# EAGLE schematic USB Interface (EAGLE 6.0)
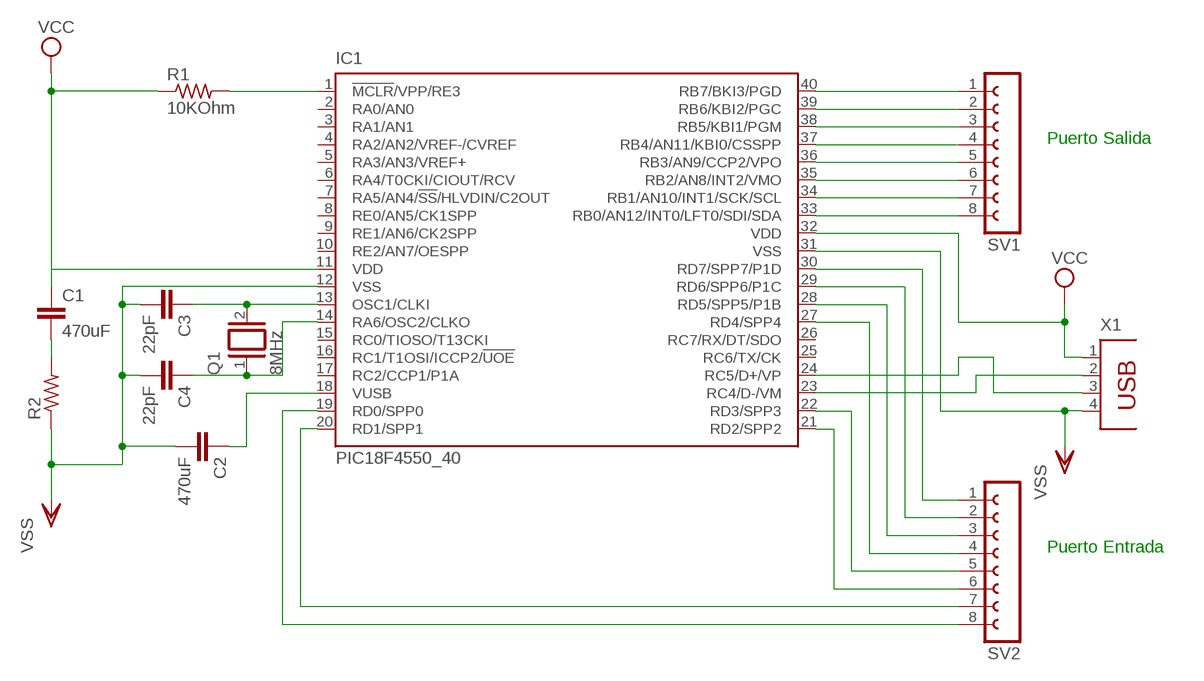
[diagram p0: schematic, sheet 1]

## Parts
C1  470uF  C2.5/4  [C2.5-4]
C2  470uF  C2.5/4  [C2.5-4]
C3  22pF  C2.5/4  [C2.5-4]
C4  22pF  C2.5/4  [C2.5-4]
IC1  PIC18F4550_40  [DIL40]
Q1  8MHz  XTAL  [Q]
R1  10KOhm  R-US_0204/2V  [0204V]
R2  R-US_0204/2V  [0204V]
SV1  FE08-1  [FE08]
SV2  FE08-1  [FE08]
X1  PN61729  [PN61729]

## Nets
N$1: IC1.1(!MCLR!/VPP/RE3) R1.2
N$2: C3.1 IC1.13(OSC1/CLKI) Q1.2
N$3: C1.2 R2.2
N$4: C4.1 IC1.14(RA6/OSC2/CLKO) Q1.1
N$5: C2.1 IC1.18(VUSB)
N$6: IC1.23(RC4/D-/VM) X1.2
N$7: IC1.24(RC5/D+/VP) X1.3
N$8: IC1.19(RD0/SPP0) SV2.8
N$9: IC1.20(RD1/SPP1) SV2.7
N$10: IC1.21(RD2/SPP2) SV2.6
N$11: IC1.22(RD3/SPP3) SV2.5
N$12: IC1.27(RD4/SPP4) SV2.4
N$13: IC1.28(RD5/SPP5/P1B) SV2.3
N$14: IC1.29(RD6/SPP6/P1C) SV2.2
N$15: IC1.30(RD7/SPP7/P1D) SV2.1
N$16: IC1.33(RB0/AN12/INT0/LFT0/SDI/SDA) SV1.8
N$17: IC1.34(RB1/AN10/INT1/SCK/SCL) SV1.7
N$18: IC1.35(RB2/AN8/INT2/VMO) SV1.6
N$19: IC1.36(RB3/AN9/CCP2/VPO) SV1.5
N$20: IC1.37(RB4/AN11/KBI0/CSSPP) SV1.4
N$21: IC1.38(RB5/KBI1/PGM) SV1.3
N$22: IC1.39(RB6/KBI2/PGC) SV1.2
N$23: IC1.40(RB7/BKI3/PGD) SV1.1
VCC: C1.1 IC1.11(VDD) IC1.32(VDD) R1.1 X1.1
VSS: C2.2 C3.2 C4.2 IC1.12(VSS) IC1.31(VSS) R2.1 X1.4
Unconnected: IC1.2(RA0/AN0) IC1.3(RA1/AN1) IC1.4(RA2/AN2/VREF-/CVREF) IC1.5(RA3/AN3/VREF+) IC1.6(RA4/T0CKI/CIOUT/RCV) IC1.7(RA5/AN4/!SS!/HLVDIN/C2OUT) IC1.8(RE0/AN5/CK1SPP) IC1.9(RE1/AN6/CK2SPP) IC1.10(RE2/AN7/OESPP) IC1.15(RC0/TIOSO/T13CKI) IC1.16(RC1/T1OSI/ICCP2/!UOE) IC1.17(RC2/CCP1/P1A) IC1.25(RC6/TX/CK) IC1.26(RC7/RX/DT/SDO)

## Notes on the sheet
- Puerto Salida
- Puerto Entrada

## Library data of the parts
C1-C4 = capacitor-wima:C: CAPACITOR naming: grid - package width
IC1 = microchip:PIC18F4*_40: USB Microcontrollers with nanoWatt Technology High-Performance, Enhanced Flash, 28/40/44-Pin, Source: http://ww1.microchip.com/downloads/en/devicedoc/39632c.pdf; MF: MICROCHIP; MPN: PIC18F4550-I/P; OC_FARNELL: 9321357; OC_NEWARK: 74K8623
Q1 = special:XTAL: CRYSTAL
R1 R2 = resistor:R-US_: RESISTOR, American symbol
SV1 SV2 = con-lsta:FE08-1: FEMALE HEADER; OC_FARNELL: unknown; OC_NEWARK: unknown
X1 = con-berg:PN61729: BERG USB connector; OC_FARNELL: unknown; OC_NEWARK: unknown